# EAGLE design electronic igniter (EAGLE 9.7.0)
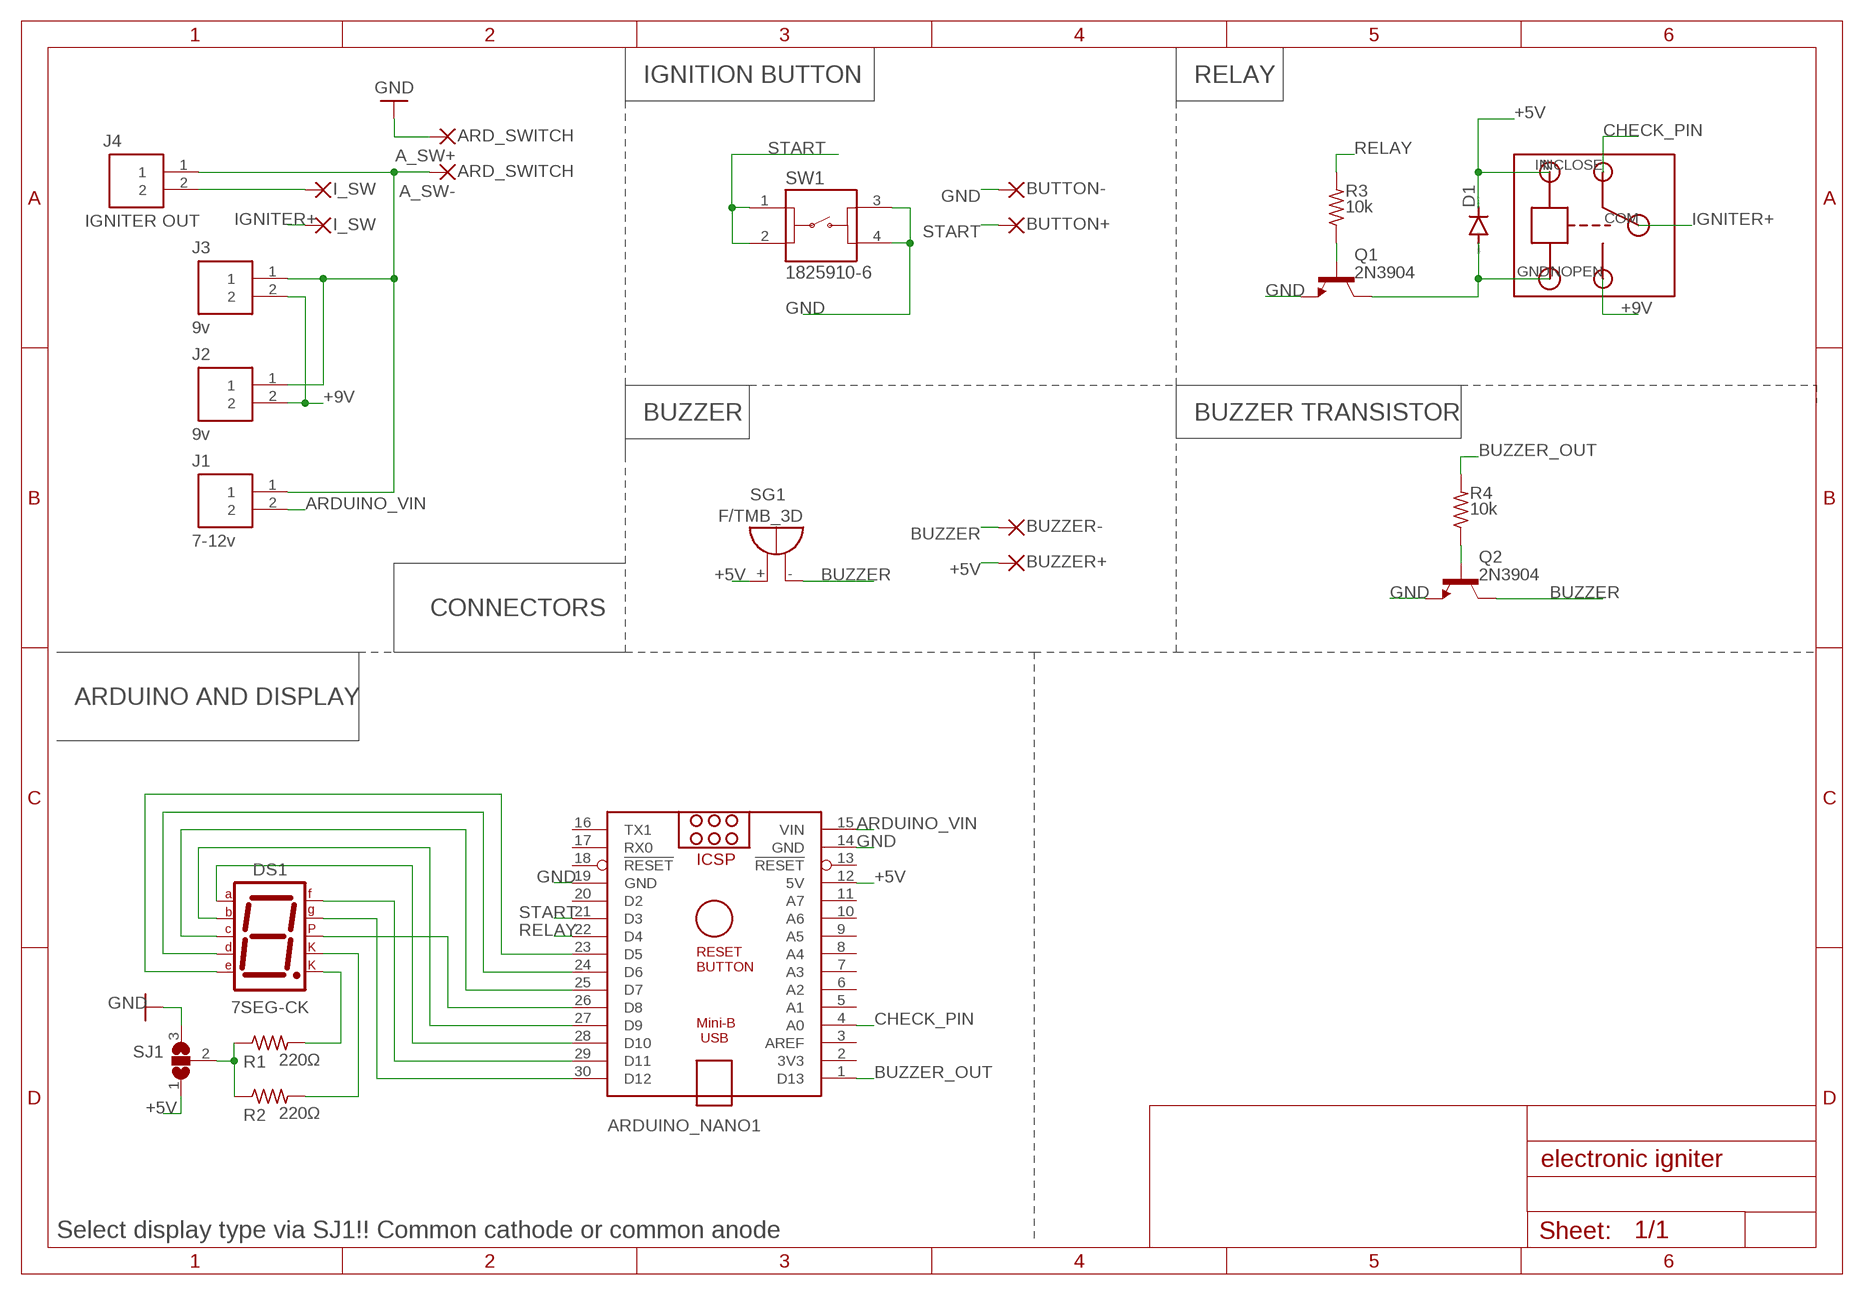
[diagram p0: schematic, sheet 1]

## Parts
A_SW+  ARD_SWITCH  2,15/1,0  [2,15/1,0]
A_SW-  ARD_SWITCH  2,15/1,0  [2,15/1,0]
ARDUINO_NANO1  ARDUINO_NANO  [ARDUINO_NANO]
BUTTON+  2,15/1,0  [2,15/1,0]
BUTTON-  2,15/1,0  [2,15/1,0]
BUZZER+  2,15/1,0  [2,15/1,0]
BUZZER-  2,15/1,0  [2,15/1,0]
D1  1N4148DO35-7  [DO35-7]
DS1  7SEG-CK  [7SEG-13]
I_SW+  I_SW  2,15/1,0  [2,15/1,0]
I_SW-  I_SW  2,15/1,0  [2,15/1,0]
J1  7-12v  1803277  [1803277]
J2  9v  1803277  [1803277]
J3  9v  1803277  [1803277]
J4  IGNITER OUT  1803277  [1803277]
Q1  2N3904  [TO92]
Q2  2N3904  [TO92]
R1  220Ω  R-US_0204/7  [0204/7]
R2  220Ω  R-US_0204/7  [0204/7]
R3  10k  R-US_0204/7  [0204/7]
R4  10k  R-US_0204/7  [0204/7]
SG1  F/TMB_3D  [F/TMB]
SJ1  SJ2WW  [SJ_2W]
SW1  1825910-6  [1825910-6]
U$1  T73  [RELAY]

## Nets
+5V: ARDUINO_NANO1.12(5V) BUZZER+.1(P) D1.C SG1.+ SJ1.1 U$1.IN
+9V: J2.2 J3.2 U$1.NOPEN
ARDUINO_VIN: ARDUINO_NANO1.15(VIN) J1.2
BUZZER: BUZZER-.1(P) Q2.1(C) SG1.-
BUZZER_OUT: ARDUINO_NANO1.1(D13) R4.2
CHECK_PIN: ARDUINO_NANO1.4(A0) U$1.NCLOSE
GND: A_SW+.1(P) ARDUINO_NANO1.14(GND) ARDUINO_NANO1.19(GND) BUTTON-.1(P) Q1.3(E) Q2.3(E) SJ1.3 SW1.3 SW1.4
IGNITER+: I_SW+.1(P) U$1.COM
IGNITER_OUT: I_SW-.1(P) J4.2
N$1: ARDUINO_NANO1.28(D10) DS1.7(A)
N$2: ARDUINO_NANO1.27(D9) DS1.6(B)
N$3: ARDUINO_NANO1.25(D7) DS1.4(C)
N$4: ARDUINO_NANO1.26(D8) DS1.5(DP)
N$5: ARDUINO_NANO1.24(D6) DS1.2(D)
N$6: ARDUINO_NANO1.23(D5) DS1.1(E)
N$7: ARDUINO_NANO1.29(D11) DS1.9(F)
N$8: ARDUINO_NANO1.30(D12) DS1.10(G)
N$9: DS1.3(CK1) R2.2
N$10: R1.1 R2.1 SJ1.2
N$11: DS1.8(CK2) R1.2
N$12: D1.A Q1.1(C) U$1.GND
N$13: Q1.2(B) R3.1
N$14: A_SW-.1(P) J1.1 J2.1 J3.1 J4.1
N$15: Q2.2(B) R4.1
RELAY: ARDUINO_NANO1.22(D4) R3.2
START: ARDUINO_NANO1.21(D3) BUTTON+.1(P) SW1.1 SW1.2
Unconnected: ARDUINO_NANO1.2(3V3) ARDUINO_NANO1.3(AREF) ARDUINO_NANO1.5(A1) ARDUINO_NANO1.6(A2) ARDUINO_NANO1.7(A3) ARDUINO_NANO1.8(A4) ARDUINO_NANO1.9(A5) ARDUINO_NANO1.10(A6) ARDUINO_NANO1.11(A7) ARDUINO_NANO1.13(!RESET) ARDUINO_NANO1.16(TX1) ARDUINO_NANO1.17(RX0) ARDUINO_NANO1.18(!RESET) ARDUINO_NANO1.20(D2)

## Notes on the sheet
- IGNITION BUTTON | RELAY
- BUZZER | BUZZER TRANSISTOR
- CONNECTORS
- ARDUINO AND DISPLAY
- Select display type via SJ1!! Common cathode or common anode

## Library data of the parts
A_SW+ A_SW- BUTTON+ BUTTON- BUZZER+ BUZZER- I_SW+ I_SW- = wirepad:2,15/1,0: THROUGH-HOLE PAD
ARDUINO_NANO1 = ArduinoNanoV30:ARDUINO_NANO: Arduino Nano V3.0 Overview: The Arduino Nano is a small, complete, and breadboard-friendly board based on the ATmega328 (Arduino Nano 3.x) or ATmega168 (Arduino Nano 2.x). It has more or less the same functionality of the Arduino Duemilanove, but in a different package. It lacks only a DC power jack, and works with a Mini-B USB cable instead of a standard one. The Nano was designed and is being produced by Gravitech. Specifications: Microcontroller Atmel ATmega168 or ATmega328 Operating Voltage (logic level) 5 V Input Voltage (recommended) 7-12 V Input Voltage (limits) 6-20 V Digital I/O Pins 14 (of which 6 provide PWM output) Analog Input Pins 8 DC Current per I/O Pin 40 mA Flash Memory 16 KB (ATmega168) or 32 KB (ATmega328) of which 2 KB used by bootloader SRAM 1 KB (ATmega168) or 2 KB (ATmega328) EEPROM 512 bytes (ATmega168) or 1 KB (ATmega328) Clock Speed 16 MHz Dimensions 0.73" x 1.70" Length 45 mm Width 18 mm Weigth 5 g Power: The Arduino Nano can be powered via the Mini-B USB connection, 6-20V unregulated external power supply (pin 30), or 5V regulated external power supply (pin 27). The power source is automatically selected to the highest voltage source. Memory: The ATmega168 has 16 KB of flash memory for storing code (of which 2 KB is used for the bootloader); the ATmega328 has 32 KB, (also with 2 KB used for the bootloader). The ATmega168 has 1 KB of SRAM and 512 bytes of EEPROM (which can be read and written with the EEPROM library); the ATmega328 has 2 KB of SRAM and 1 KB of EEPROM. Input and Output: Each of the 14 digital pins on the Nano can be used as an input or output, using pinMode(), digitalWrite(), and digitalRead() functions. They operate at 5 volts. Each pin can provide or receive a maximum of 40 mA and has an internal pull-up resistor (disconnected by default) of 20-50 kOhms. In addition, some pins have specialized functions. Visit Arduino - ArduinoBoardNano <https://www.arduino.cc/en/Main/ArduinoBoardNano>
D1 = diode:1N4148: DIODE high speed (Philips)
DS1 = Opto-Electronic:7SEG-CK: 7-segment DISPLAY single cathode, 13 mm; CATEGORY: Opto-Electronic; SUB-CATEGORY: Display; TYPE: 7-Segment
J1-J4 = Connectors:1803277: TERM BLOCK HDR 2POS 90DEG 3.81MM Manufacturer's datasheet <https://media.digikey.com/pdf/Data%20Sheets/Phoenix%20Contact%20PDFs/1803277.pdf>; CREATED_BY: PCBLayout.com; DIGI_KEY_PART_NUMBER: 277-1206-ND; MANUFACTURER: Phoenix Contact; MPN: 1803277; PACKAGE: THROUGH HOLE
Q1 Q2 = transistor-npn:2N3904: NPN Transistor
R1-R4 = resistor:R-US_: RESISTOR, American symbol
SG1 = buzzer:F/TMB_3D: BUZZER Source: Buerklin; OC_FARNELL: unknown; OC_NEWARK: unknown
SJ1 = jumper:SJ2W: SMD solder JUMPER
SW1 = Switch:1825910-6: SWITCH TACTILE SPST-NO 0.05A 24V Manufacturer's datasheet <https://www.te.com/commerce/DocumentDelivery/DDEController?Action=srchrtrv&DocNm=1825910&DocType=Customer+Drawing&DocLang=English>; CREATED_BY: PCBLayout.com; DIGIKEY_PART_NUMBER: 450-1650-ND; MANUFACTURER: TE Connectivity ALCOSWITCH Switches; MPN: 1825910-6
U$1 = RELAY:T73

## Net classes
0 default: width 0.508 mm, drill 0.9 mm, clearance 0.508 mm

## Board
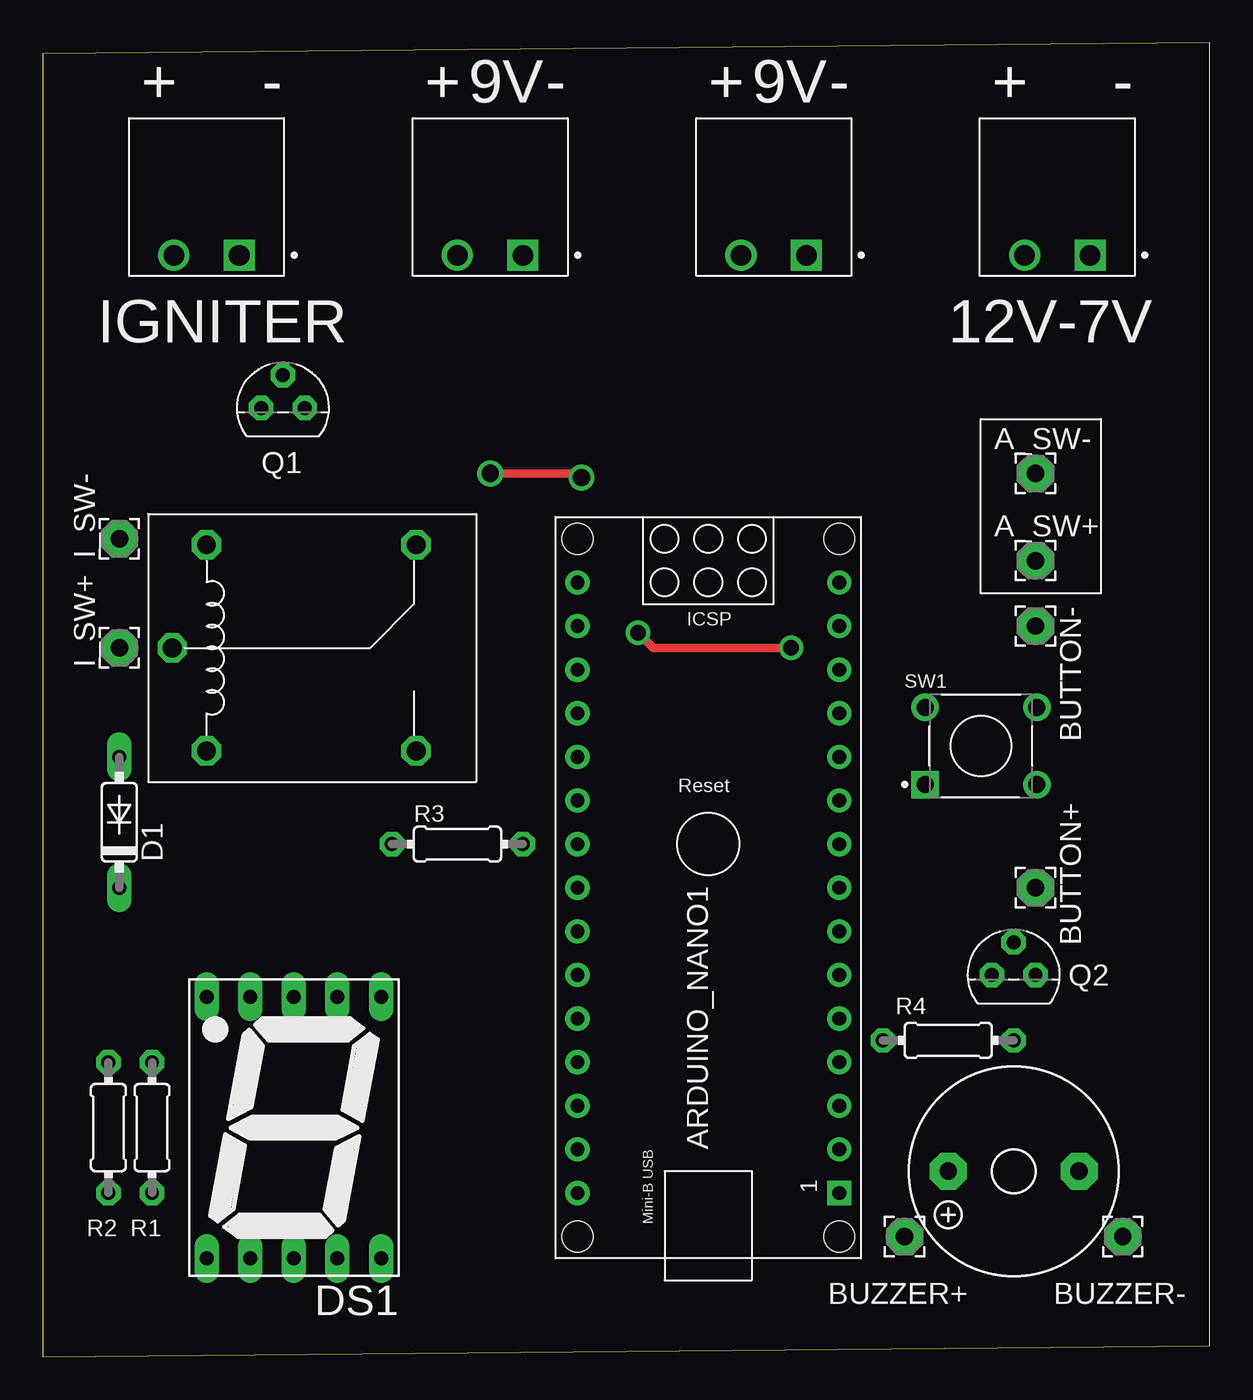
[diagram p1: board, top side]
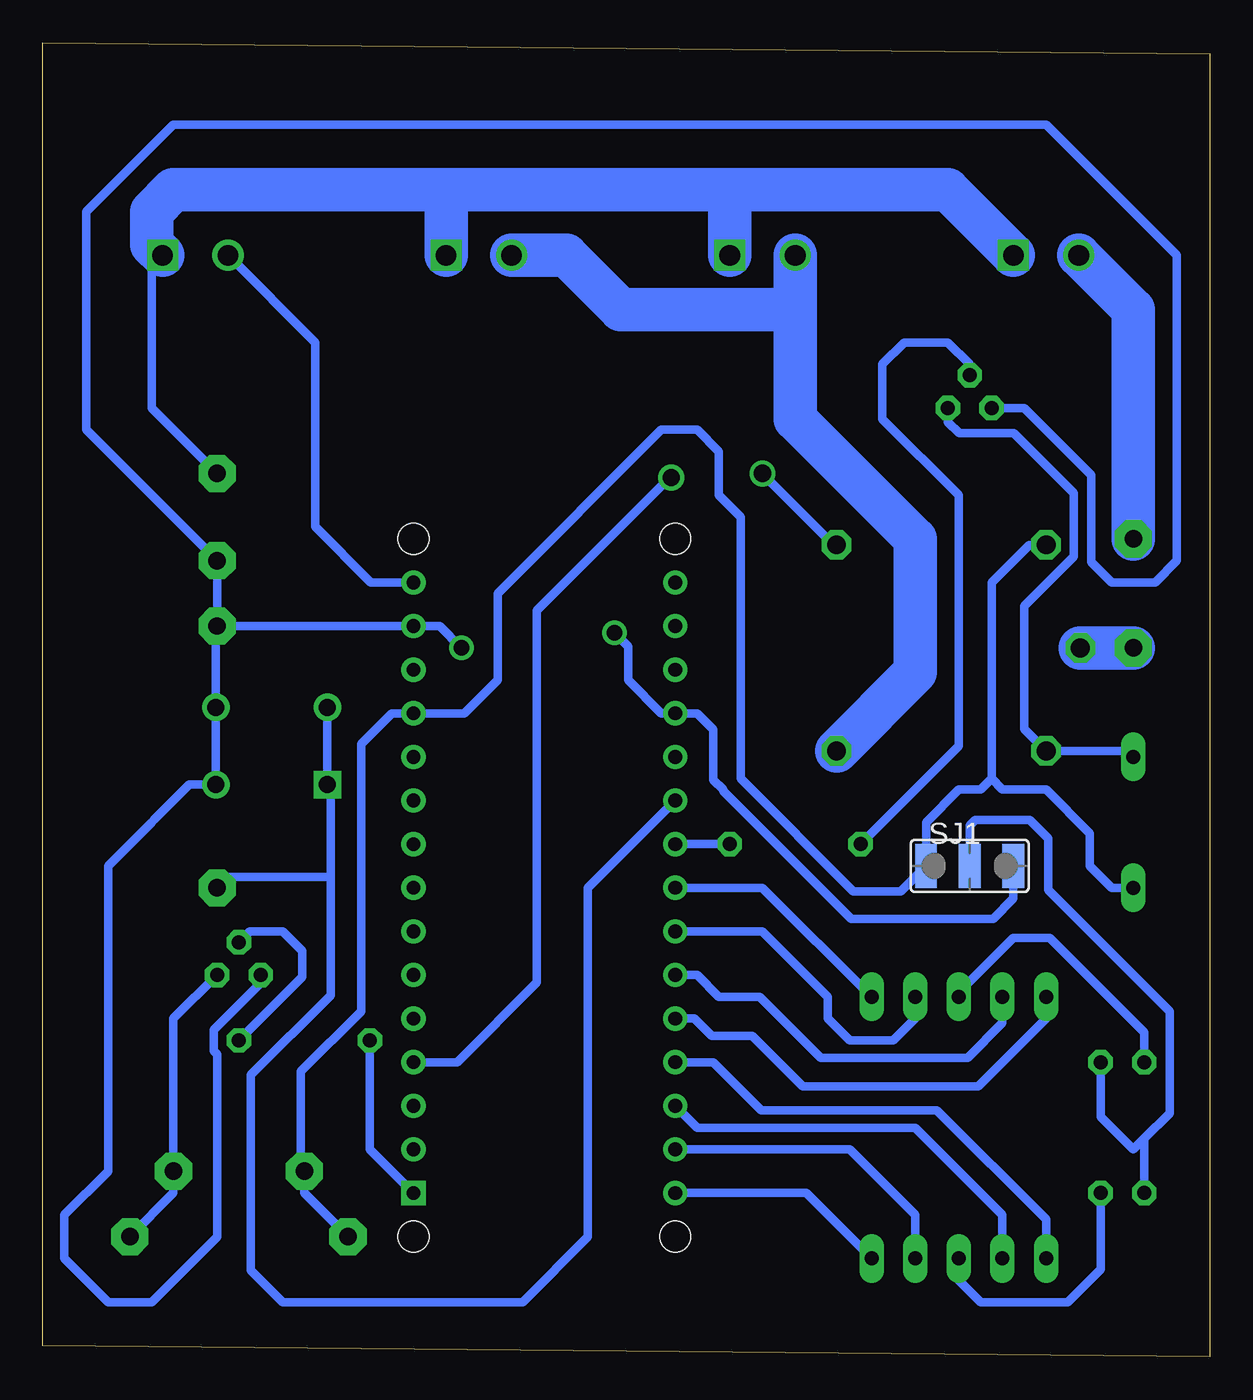
[diagram p2: board, bottom side, seen from below]

Size 67.92 x 76.51 mm. Coordinates in mm from the lower left corner, seen from the top.
Outline: 0,0 67.92,0.64 67.92,76.51 0,75.87 0,0
Copper layers (1*16): Top 0.035mm / dielectric 1.5mm / Bottom 0.035mm
Design rules "cncDesignRules": minimum track width 8mil, minimum drill 0.9mm, track to track 11mil, track to pad 11mil, pad to pad 11mil, via to via 12mil, smd to smd 8mil, copper to edge 10mil, drill to drill 8mil, minimum pad ring 12mil, minimum via ring 10mil, stop-mask expansion 4mil, vias tented up to drill 25mil, thermal gap 12mil

### Footprints (pad centres in the part's own frame; a part is rotated, then mirrored left to right if it is on the bottom)
2,15/1,0 = drill 1.016 pad 2.159 octagon: 1 0,0
ARDUINO_NANO = drill 0.8 square: 1 -20.32,-7.62 | drill 0.8: 2 -17.78,-7.62; 3 -15.24,-7.62; 4 -12.7,-7.62; 5 -10.16,-7.62; 6 -7.62,-7.62; 7 -5.08,-7.62; 8 -2.54,-7.62; 9 0,-7.62; 10 2.54,-7.62; 11 5.08,-7.62; 12 7.62,-7.62; 13 10.16,-7.62; 14 12.7,-7.62; 15 15.24,-7.62; 16 15.24,7.62; 17 12.7,7.62; 18 10.16,7.62; 19 7.62,7.62; 20 5.08,7.62; 21 2.54,7.62; 22 0,7.62; 23 -2.54,7.62; 24 -5.08,7.62; 25 -7.62,7.62; 26 -10.16,7.62; 27 -12.7,7.62; 28 -15.24,7.62; 29 -17.78,7.62; 30 -20.32,7.62 | hole 1.778: -22.86,-7.62; -22.86,7.62; 17.78,7.62; 17.78,-7.62
DO35-7 = drill 0.813 long: A 3.81,0; C -3.81,0
7SEG-13 = drill 0.813 long: 1 -5.08,-7.62; 2 -2.54,-7.62; 3 0,-7.62; 4 2.54,-7.62; 5 5.08,-7.62; 6 5.08,7.62; 7 2.54,7.62; 8 0,7.62; 9 -2.54,7.62; 10 -5.08,7.62
1803277 = drill 1.2 square: 1 -1.905,0 | drill 1.2: 2 1.905,0
TO92 = drill 0.813 octagon: 1 1.27,0; 2 0,1.905; 3 -1.27,0
0204/7 = drill 0.813 octagon: 1 -3.81,0; 2 3.81,0
F/TMB = drill 1.016 pad 2.159 octagon: + 3.81,0; - -3.81,0
SJ_2W = smd 1.27 x 2.54: 1 -2.54,0; 2 0,0; 3 2.54,0
1825910-6 = drill 0.99 square: 1 3.25,2.25 | drill 0.99: 2 3.25,-2.25; 3 -3.25,2.25; 4 -3.25,-2.25
RELAY = drill 1.1 octagon: COM -2,0; GND 0,-6; IN 0,6; NCLOSE 12.2,6; NOPEN 12.2,-6

### Placement (x,y rotation side)
A_SW+  57.79,46.35 0 top
A_SW-  57.79,51.43 180 top
ARDUINO_NANO1  38.73,29.85 90 top
BUTTON+  57.79,27.31 180 top
BUTTON-  57.79,42.54 270 top
BUZZER+  50.16,6.98 0 top
BUZZER-  62.87,6.98 180 top
D1  4.45,31.12 90 top
DS1  14.6,13.33 180 top
I_SW+  4.45,41.27 90 top
I_SW-  4.45,47.62 90 top
J1  59.05,64.14 180 top
J2  26.04,64.14 180 top
J3  42.55,64.14 180 top
J4  9.53,64.14 180 top
Q1  13.97,55.24 0 top
Q2  56.52,22.23 0 top
R1  6.35,13.33 270 top
R2  3.81,13.33 90 top
R3  24.13,29.85 0 top
R4  52.7,18.42 180 top
SG1  56.52,10.79 180 top
SJ1  13.97,28.58 0 bottom
SW1  54.61,35.56 180 top
U$1  9.53,41.27 0 top

### Tracks (layer width: path | path; a pad name or v marks a point on that pad's centre or on a via)
+5V
  Bottom 0.508: U$1.IN 10.51,47.27 12.7,45.09 12.7,33.66 | 12.7,33.66 13.33,33.02 14.6,33.02 16.51,31.12 SJ1.1 17.98,27.1 20.75,27.1 27.3,33.66 27.3,48.89 28.58,50.16 28.58,52.7 29.85,53.98 31.94,53.98 41.46,44.45 41.46,39.4 43.39,37.46 ARDUINO_NANO1.12 47.62,37.46 49.4,35.69 49.4,20.11 52.91,16.61 52.91,11 SG1.+ 52.7,9.53 BUZZER+.1 | D1.C 5.71,27.31 6.99,28.58 6.99,30.48 9.53,33.02 12.06,33.02 12.7,33.66
+9V
  Bottom 2.54: J2.2 24.13,60.96 | 24.13,60.96 34.29,60.96 37.47,64.14 J3.2 | U$1.NOPEN 17.14,39.85 17.14,47.62 24.13,54.61 24.13,60.96
ARDUINO_VIN
  Bottom 0.508: ARDUINO_NANO1.15 48.83,45.09 52.07,48.32 52.07,59.05 J1.2
BUZZER
  Bottom 0.508: Q2.1 60.33,19.69 SG1.- 60.33,9.53 BUZZER-.1
BUZZER_OUT
  Bottom 0.508: ARDUINO_NANO1.1 48.9,12.06 R4.2
CHECK_PIN  (via drill 1)
  Top 0.508: v26.04,51.43 31.12,51.43 v31.35,51.2
  Bottom 0.508: ARDUINO_NANO1.4 43.81,17.15 39.17,21.79 39.17,43.45 31.43,51.2 v31.35,51.2 | v26.04,51.43 21.88,47.27 U$1.NCLOSE
GND  (via drill 0.9)
  Top 0.508: v34.65,42.15 35.52,41.27 v43.56,41.27
  Bottom 0.508: BUTTON-.1 ARDUINO_NANO1.14 44.83,42.54 v43.56,41.27 | Q2.3 55.25,21.77 57.99,19.03 57.99,17.81 57.79,17.6 57.79,6.98 61.59,3.17 64.13,3.17 66.67,5.71 66.67,8.26 64.13,10.79 64.13,28.58 61.59,31.12 61.47,31.24 59.4,33.31 SW1.3 SW1.4 57.86,42.47 BUTTON-.1 | v34.65,42.15 33.85,41.36 33.85,39.4 31.92,37.46 ARDUINO_NANO1.19 29.85,37.46 28.89,36.51 28.89,33.59 28.32,33.02 28.32,32.94 20.87,25.49 12.61,25.49 11.43,26.67 SJ1.3 | BUTTON-.1 A_SW+.1 65.41,53.98 65.41,66.68 60.33,71.76 9.53,71.76 1.91,64.14 1.91,46.35 3.17,45.09 5.71,45.09 6.89,46.26 6.89,51.34 10.79,55.24 Q1.3
IGNITER+
  Bottom 2.54: U$1.COM I_SW+.1
IGNITER_OUT
  Bottom 2.54: I_SW-.1 4.45,60.96 J4.2
N$1
  Bottom 0.508: DS1.7 12.06,8.26 17.14,13.33 29.85,13.33 ARDUINO_NANO1.28
N$2
  Bottom 0.508: ARDUINO_NANO1.27 28.91,17.15 26.12,14.35 15.88,14.35 9.53,8 DS1.6
N$3
  Bottom 0.508: DS1.4 12.06,19.43 14.1,17.4 22.65,17.4 26.2,20.96 28.58,20.96 29.85,22.23 ARDUINO_NANO1.25
N$4
  Bottom 0.508: DS1.5 9.53,19.69 13.46,15.75 23.7,15.75 26.62,18.67 29,18.67 30.01,19.69 ARDUINO_NANO1.26
N$5
  Bottom 0.508: DS1.2 17.14,19.69 18.42,18.42 20.96,18.42 22.23,19.69 22.23,20.96 26.04,24.77 ARDUINO_NANO1.24
N$6
  Bottom 0.508: DS1.1 26.04,27.31 ARDUINO_NANO1.23
N$7
  Bottom 0.508: DS1.9 17.14,8.26 20.96,12.06 ARDUINO_NANO1.29
N$8
  Bottom 0.508: DS1.10 23.5,9.53 ARDUINO_NANO1.30
N$9
  Bottom 0.508: R2.2 3.81,18.88 9.31,24.38 11.43,24.38 14.6,21.21 DS1.3
N$10
  Bottom 0.508: R1.1 6.35,13.97 4.45,12.06 3.81,12.7 | R2.1 3.81,12.7 | 3.81,12.7 2.34,14.17 2.34,20.12 9.4,27.18 9.4,30.16 10.48,31.24 13.65,31.24 13.97,30.92 SJ1.2
N$11
  Bottom 0.508: R1.2 6.35,5.08 8.25,3.17 13.33,3.17 14.6,4.45 DS1.8
N$12
  Bottom 0.508: D1.A 4.79,35.27 U$1.GND 10.79,36.54 10.79,43.72 7.91,46.6 7.91,50.29 11.39,53.77 14.58,53.77 15.24,54.43 Q1.1
N$13
  Bottom 0.508: R3.1 14.6,35.56 14.6,50.16 19.05,54.61 19.05,57.78 17.78,59.05 15.24,59.05 13.97,57.78 Q1.2
N$14
  Bottom 0.508: A_SW-.1 61.59,55.24 61.59,64.77
  Bottom 2.54: J4.1 15.24,67.95 27.3,67.95 | 27.3,67.95 27.94,67.31 J2.1 | 27.3,67.95 45.09,67.95 | J3.1 44.45,67.31 45.09,67.95 | 45.09,67.95 60.33,67.95 61.59,66.68 61.59,64.77 J1.1
N$15
  Bottom 0.508: Q2.2 55.88,24.77 53.98,24.77 52.83,23.62 52.83,22.1 R4.1
RELAY
  Bottom 0.508: ARDUINO_NANO1.22 R3.2
START
  Bottom 0.508: BUTTON+.1 57.15,27.94 51.18,27.94 | ARDUINO_NANO1.21 36.2,27.31 36.2,6.98 40.01,3.17 53.98,3.17 55.82,5.02 55.82,16.41 51.18,21.04 51.18,27.94 | 51.18,27.94 51.18,33.13 SW1.1 SW1.2

### Text on the board
tPlace: + - | + - | 9V | + - | 9V | + - | IGNITER | 12V-7V